# EAGLE design MotorDriver (EAGLE 6.6.0)

## Sheet 1 of 2
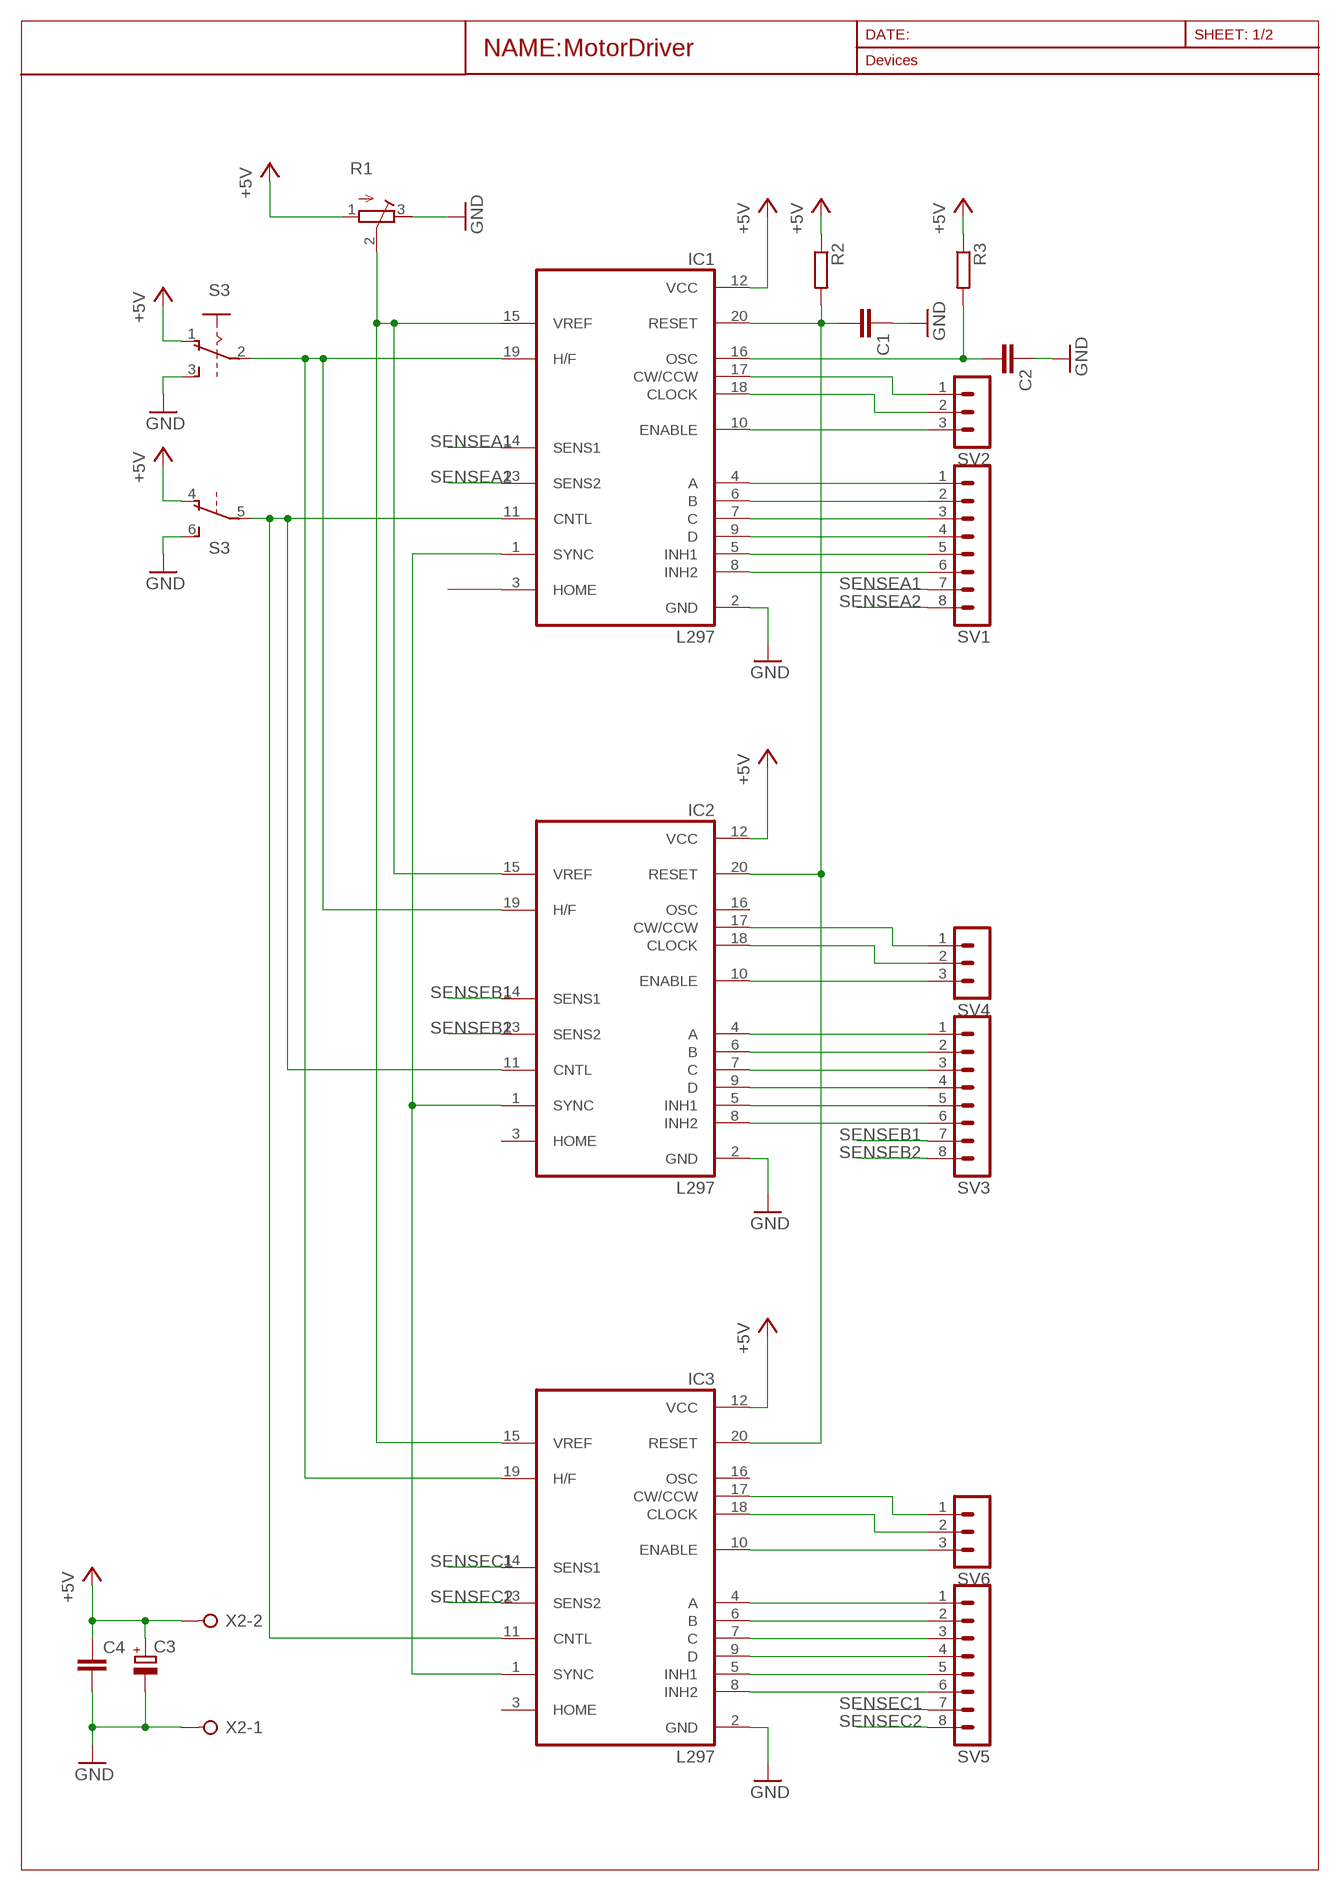
[diagram p0: schematic, sheet 1]

### Parts
C1  C-EU050-024X044  [C050-024X044]
C2  C-EU050-024X044  [C050-024X044]
C3  CPOL-EUE3.5-8  [E3,5-8]
C4  C-EU050-024X044  [C050-024X044]
IC1  L297  [DIL20]
IC2  L297  [DIL20]
IC3  L297  [DIL20]
R1  R-TRIMM64P  [RTRIM64P]
R2  R-EU_0207/10  [0207/10]
R3  R-EU_0207/10  [0207/10]
S3  A68-A31  [A68-A31]
SV1  MA08-1  [MA08-1]
SV2  MA03-1  [MA03-1]
SV3  MA08-1  [MA08-1]
SV4  MA03-1  [MA03-1]
SV5  MA08-1  [MA08-1]
SV6  MA03-1  [MA03-1]
X2  W237-02P  [W237-132]

### Nets
+5V: C3.+ C4.1 IC1.12(VCC) IC2.12(VCC) IC3.12(VCC) R1.1(A) R2.1 R3.1 S3.1(A:O) S3.4(B:O) X2.2
GND: C1.1 C2.1 C3.- C4.2 IC1.2(GND) IC2.2(GND) IC3.2(GND) R1.3(E) S3.3(A:S) S3.6(B:S) X2.1
N$3: C2.2 IC1.16(OSC) R3.2
N$4: IC1.4(A) SV1.1
N$5: IC1.6(B) SV1.2
N$6: IC1.7(C) SV1.3
N$7: IC1.9(D) SV1.4
N$8: IC1.5(INH1) SV1.5
N$9: IC1.8(INH2) SV1.6
N$12: IC1.17(CW/CCW) SV2.1
N$13: IC1.18(CLOCK) SV2.2
N$14: IC1.10(ENABLE) SV2.3
N$17: IC1.19(H/F) IC2.19(H/F) IC3.19(H/F) S3.2(A:P)
N$22: IC1.3(HOME)
N$26: IC1.11(CNTL) IC2.11(CNTL) IC3.11(CNTL) S3.5(B:P)
N$27: IC1.15(VREF) IC2.15(VREF) IC3.15(VREF) R1.2(S)
N$30: IC2.4(A) SV3.1
N$31: IC2.6(B) SV3.2
N$32: IC2.7(C) SV3.3
N$33: IC2.9(D) SV3.4
N$34: IC2.5(INH1) SV3.5
N$35: IC2.8(INH2) SV3.6
N$38: IC2.17(CW/CCW) SV4.1
N$39: IC2.18(CLOCK) SV4.2
N$40: IC2.10(ENABLE) SV4.3
N$45: IC1.1(SYNC) IC2.1(SYNC) IC3.1(SYNC)
N$48: C1.2 IC1.20(RESET) IC2.20(RESET) IC3.20(RESET) R2.2
N$50: IC3.4(A) SV5.1
N$51: IC3.6(B) SV5.2
N$52: IC3.7(C) SV5.3
N$53: IC3.9(D) SV5.4
N$54: IC3.5(INH1) SV5.5
N$55: IC3.8(INH2) SV5.6
N$58: IC3.17(CW/CCW) SV6.1
N$59: IC3.18(CLOCK) SV6.2
N$60: IC3.10(ENABLE) SV6.3
SENSEA1: IC1.14(SENS1) SV1.7
SENSEA2: IC1.13(SENS2) SV1.8
SENSEB1: IC2.14(SENS1) SV3.7
SENSEB2: IC2.13(SENS2) SV3.8
SENSEC1: IC3.14(SENS1) SV5.7
SENSEC2: IC3.13(SENS2) SV5.8
Unconnected: IC2.3(HOME) IC2.16(OSC) IC3.3(HOME) IC3.16(OSC)

## Sheet 2 of 2

## Library data of the parts
C1 C2 C4 = rcl:C-EU: CAPACITOR, European symbol
C3 = rcl:CPOL-EU: POLARIZED CAPACITOR, European symbol
IC1-IC3 = st-microelectronics:L297: STEPPER MOTOR CONTROLLER; MPN: L297/1; OC_FARNELL: 1094209; OC_NEWARK: 56P8258
R1 = rcl:R-TRIMM: Trimm resistor
R2 R3 = rcl:R-EU_: RESISTOR, European symbol
S3 = switch:A68-A31: SLIDING SWITCH Siemens, distributor Buerklin, 11G766
SV1 SV3 SV5 = con-lstb:MA08-1: PIN HEADER; OC_FARNELL: unknown; OC_NEWARK: unknown
SV2 SV4 SV6 = con-lstb:MA03-1: PIN HEADER; OC_FARNELL: unknown; OC_NEWARK: unknown
X2 = con-wago-508:W237-02P: WAGO SREW CLAMP; OC_FARNELL: unknown; OC_NEWARK: unknown

## Board
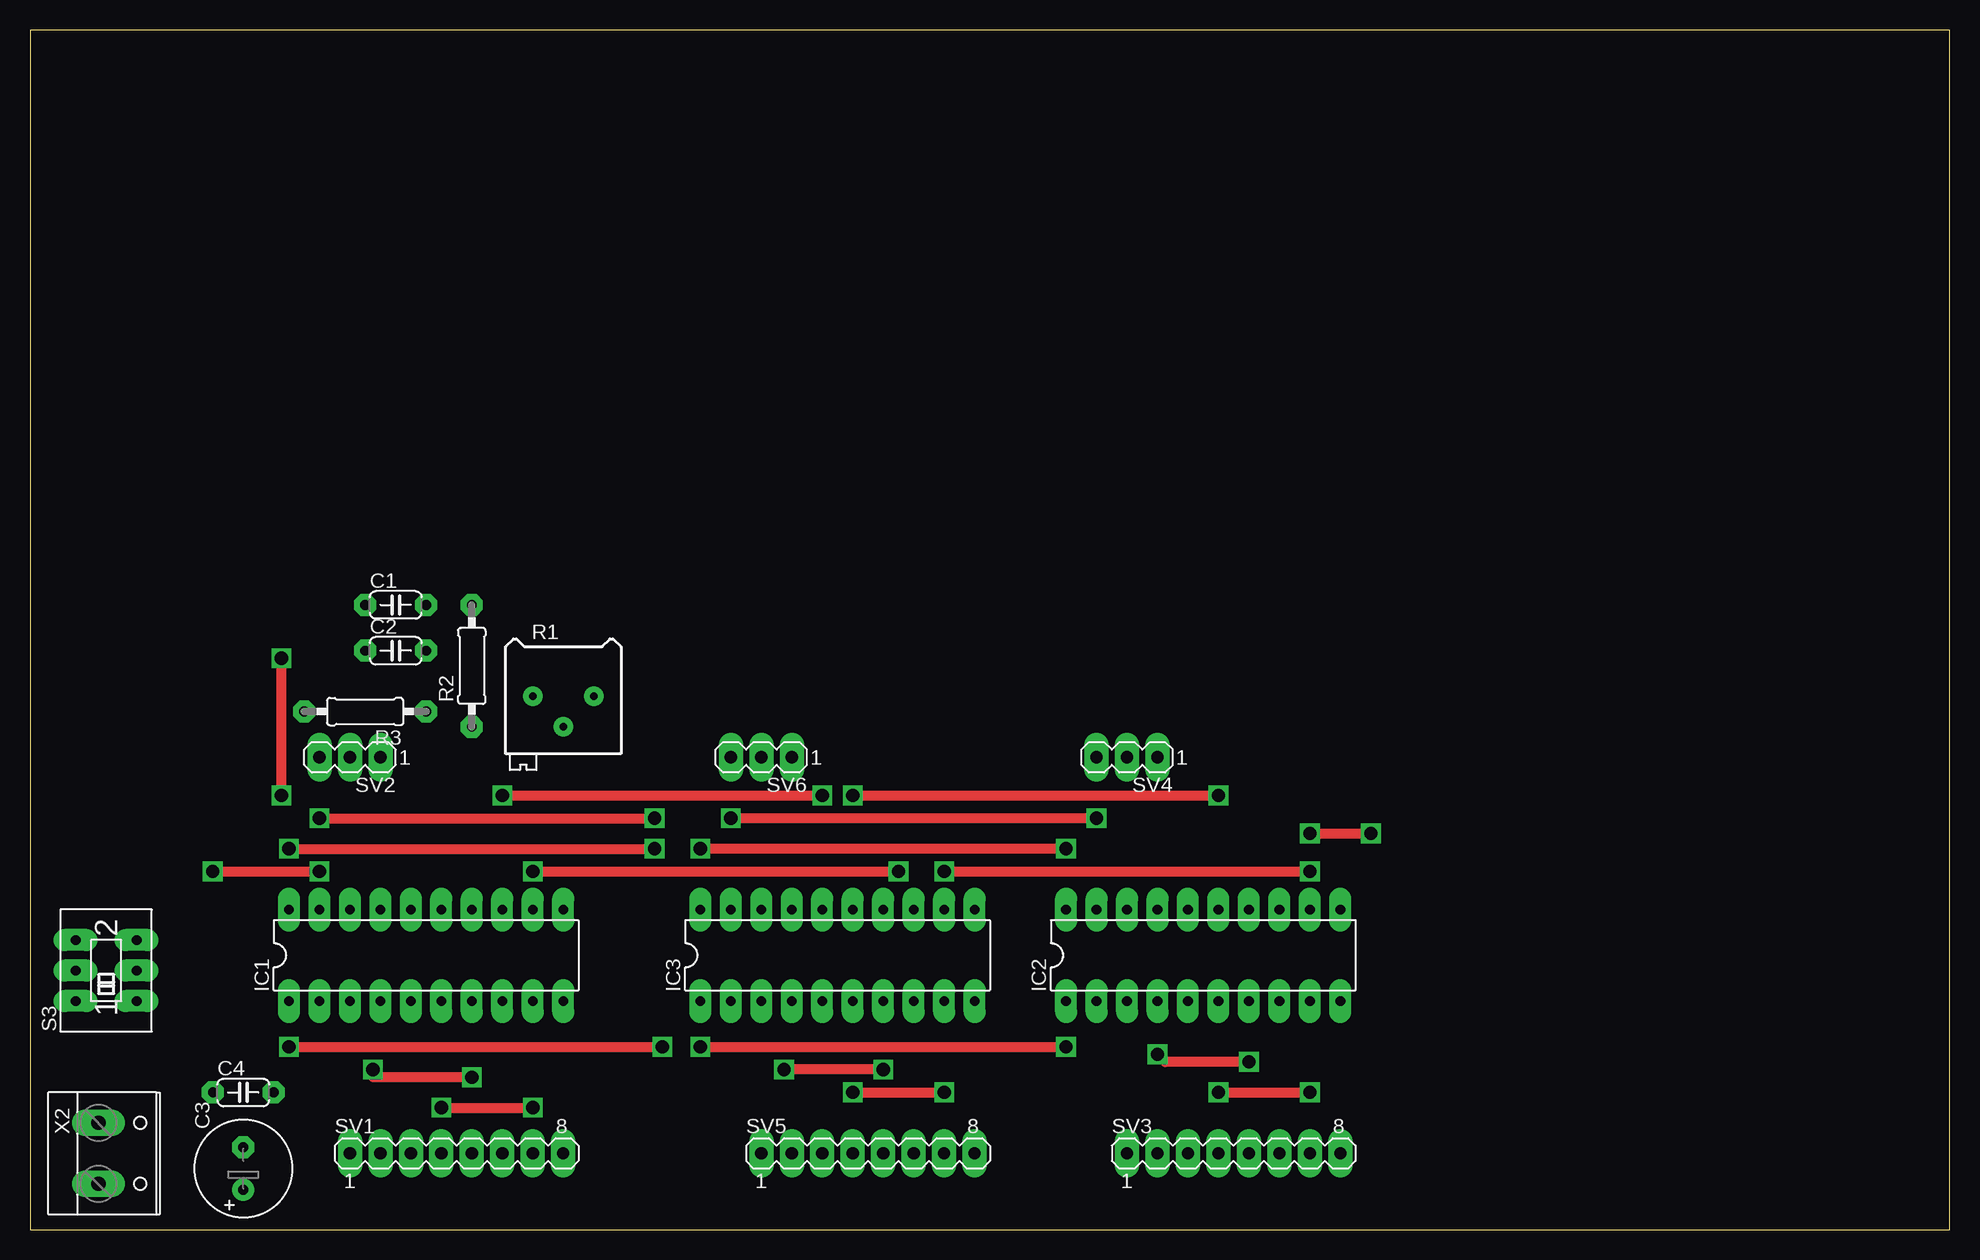
[diagram p1: board, top side]
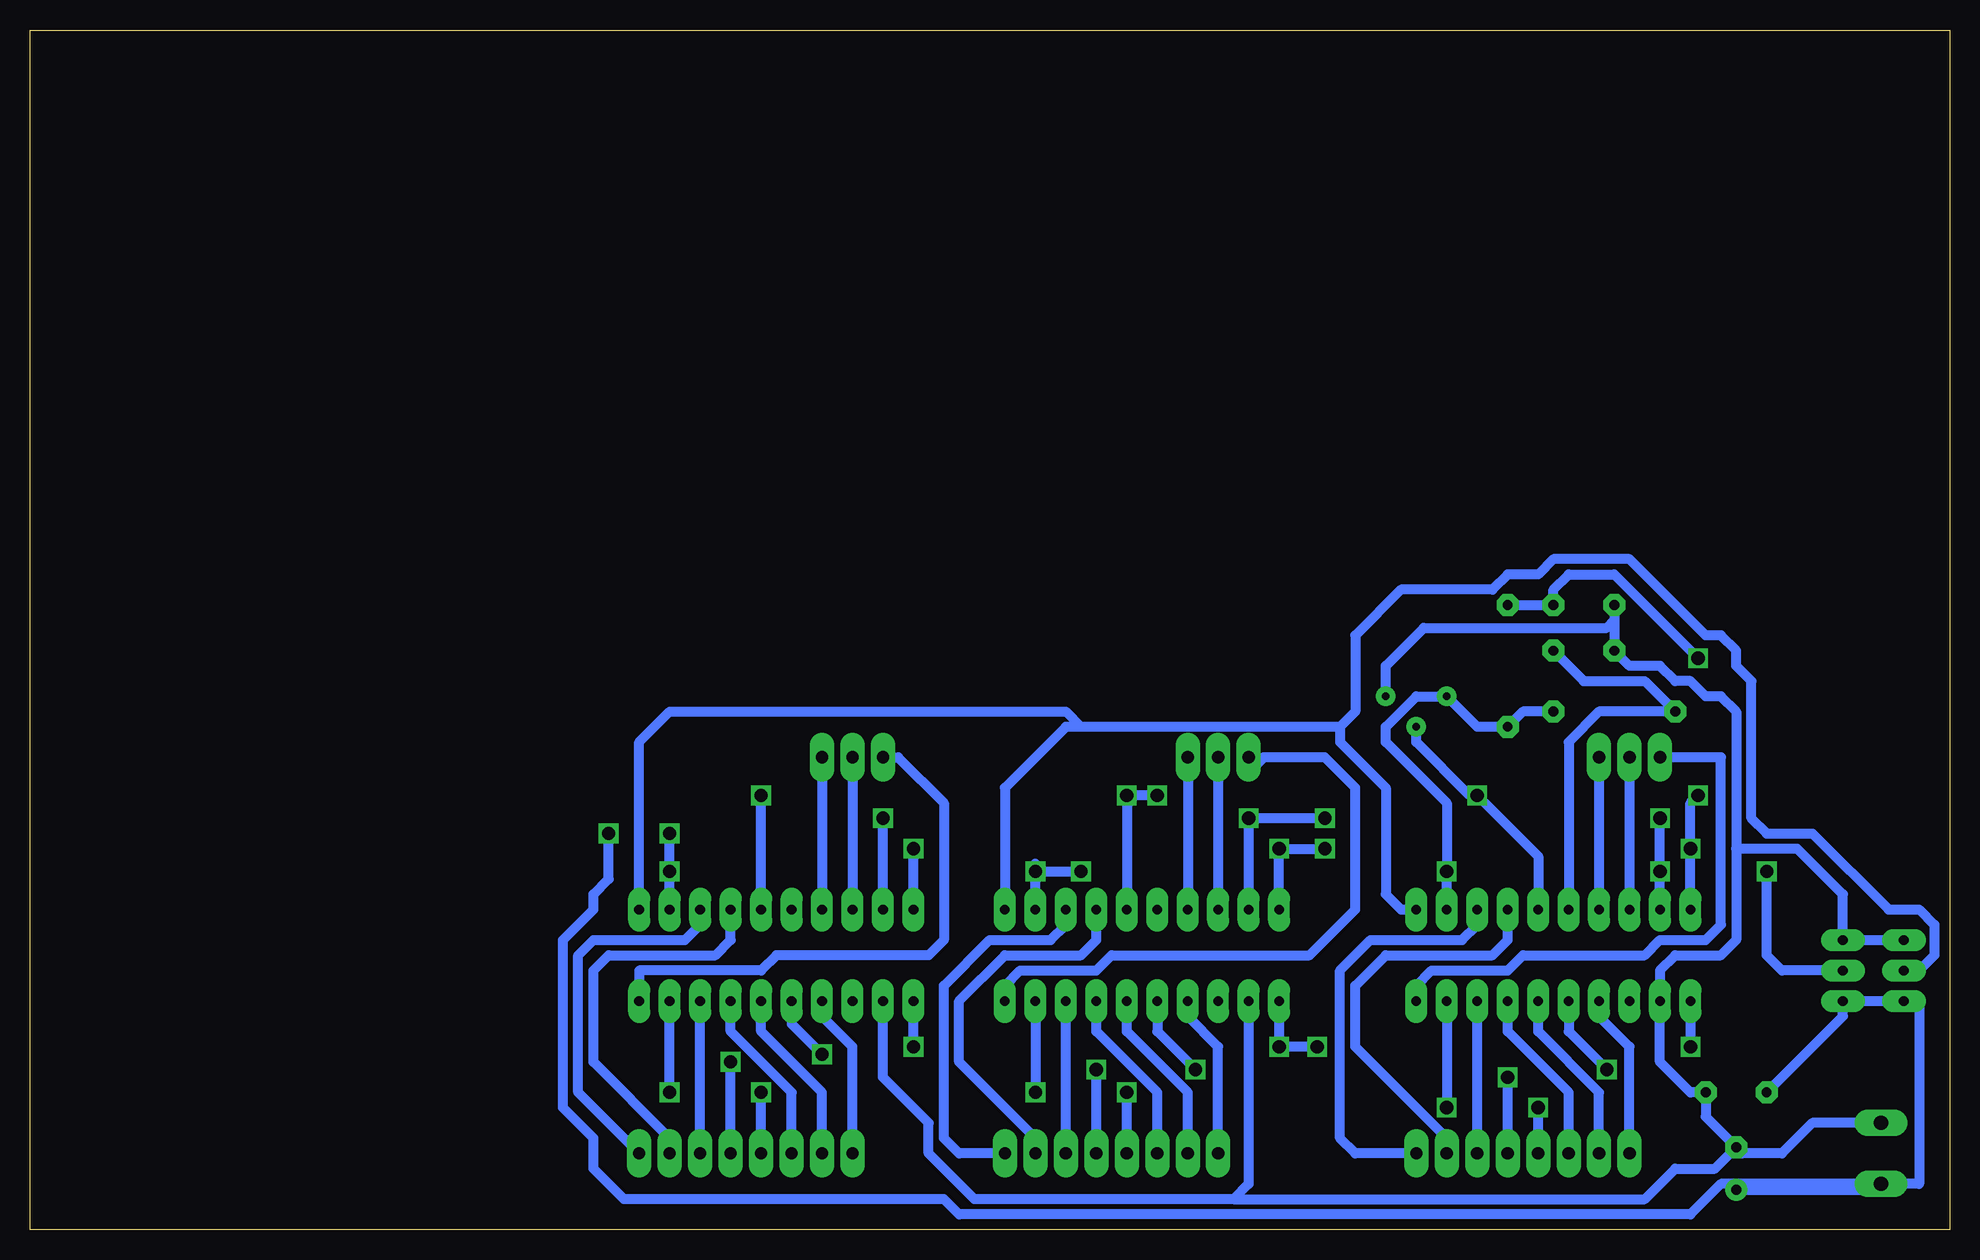
[diagram p2: board, bottom side, seen from below]

Size 160 x 100 mm. Coordinates in mm from the lower left corner, seen from the top.
Outline: 0,0 160,0 160,100 0,100 0,0
Copper layers (1*16): Top 0.035mm / dielectric 1.5mm / Bottom 0.035mm
Design rules "default *": minimum track width 10mil, minimum drill 24mil, track to track 8mil, track to pad 8mil, pad to pad 8mil, via to via 8mil, smd to smd 8mil, copper to edge 40mil, drill to drill 8mil, minimum pad ring 20mil, minimum via ring 8mil, stop-mask expansion 4mil, vias tented up to drill 0mil, thermal gap 10mil

### Footprints (pad centres in the part's own frame; a part is rotated, then mirrored left to right if it is on the bottom)
C050-024X044 = drill 0.813 octagon: 1 -2.54,0; 2 2.54,0
E3,5-8 = drill 0.813 pad 1.6: + -1.778,0 | drill 0.813 pad 1.6 octagon: - 1.778,0
DIL20 = drill 0.813 long: 1 -11.43,-3.81; 2 -8.89,-3.81; 3 -6.35,-3.81; 4 -3.81,-3.81; 5 -1.27,-3.81; 6 1.27,-3.81; 7 3.81,-3.81; 8 6.35,-3.81; 9 8.89,-3.81; 10 11.43,-3.81; 11 11.43,3.81; 12 8.89,3.81; 13 6.35,3.81; 14 3.81,3.81; 15 1.27,3.81; 16 -1.27,3.81; 17 -3.81,3.81; 18 -6.35,3.81; 19 -8.89,3.81; 20 -11.43,3.81
RTRIM64P = drill 0.61: 1 0,-2.54; 2 2.54,0; 3 0,2.54
0207/10 = drill 0.813 octagon: 1 -5.08,0; 2 5.08,0
A68-A31 = drill 0.813 long: 1 -2.54,-2.54; 2 0,-2.54; 3 2.54,-2.54; 4 -2.54,2.54; 5 0,2.54; 6 2.54,2.54
MA08-1 = drill 1.016 long: 1 -8.89,0; 2 -6.35,0; 3 -3.81,0; 4 -1.27,0; 5 1.27,0; 6 3.81,0; 7 6.35,0; 8 8.89,0
MA03-1 = drill 1.016 long: 1 -2.54,0; 2 0,0; 3 2.54,0
W237-132 = drill 1.194 long: 1 -2.54,-0.635; 2 2.54,-0.635

### Placement (x,y rotation side)
C1  30.48,52.07 0 top
C2  30.48,48.26 0 top
C3  17.78,5.08 90 top
C4  17.78,11.43 0 top
IC1  33.02,22.86 0 top
IC2  97.79,22.86 0 top
IC3  67.31,22.86 0 top
R1  44.45,44.45 270 top
R2  36.83,46.99 90 top
R3  27.94,43.18 180 top
S3  6.35,21.59 90 top
SV1  35.56,6.35 0 top
SV2  26.67,39.37 180 top
SV3  100.33,6.35 0 top
SV4  91.44,39.37 180 top
SV5  69.85,6.35 0 top
SV6  60.96,39.37 180 top
X2  6.35,6.35 270 top

### Tracks (layer width: path | path; a pad name or v marks a point on that pad's centre or on a via)
+5V  (via drill 1.1 pad 0.25)
  Top 0.813: v41.91,29.84 v72.39,29.84 | v76.2,29.84 v106.68,29.84 | v106.68,33.02 v111.76,33.02
  Bottom 0.813: S3.1 S3.4 | C3.+ 6.22,3.3 X2.2 | R3.1 35.56,43.18 R2.1 39.37,41.91 R1.1 44.45,44.45 46.99,41.91 46.99,40.64 41.91,35.56 v41.91,29.84 IC1.12 | IC2.12 v106.68,29.84 v106.68,33.02 | v76.2,29.84 v72.39,29.84 | IC3.12 v76.2,29.84 | 76.2,30.48 v76.2,29.84 | X2.2 2.54,3.81 2.54,19.05 S3.1 | C4.1 8.89,17.78 S3.1 | X2.2 19.05,3.81 21.59,1.27 82.55,1.27 83.82,2.54 110.49,2.54 113.03,5.08 113.03,7.62 115.57,10.16 115.57,24.13 113.03,26.67 113.03,27.94 111.76,29.21 v111.76,33.02
GND
  Bottom 0.813: C1.1 27.94,50.8 | 27.94,50.8 C2.1 26.67,46.99 24.13,46.99 22.86,45.72 21.59,45.72 20.32,44.45 19.05,44.45 17.78,43.18 17.78,31.75 | R1.3 46.99,46.99 43.81,50.16 28.57,50.16 27.94,50.8 | S3.6 S3.3 8.89,27.94 12.7,31.75 17.78,31.75 | C3.- 20.32,9.4 C4.2 21.59,11.43 24.13,13.97 IC1.2 24.13,21.59 22.86,22.86 19.05,22.86 17.78,24.13 17.78,31.75 | X2.1 11.43,8.89 13.97,6.35 17.27,6.35 C3.- | 59.69,2.54 81.28,2.54 85.09,6.35 85.09,8.89 88.9,12.7 IC2.2 | IC3.2 58.42,3.81 59.69,2.54 | 59.69,2.54 25.4,2.54 22.86,5.08 19.56,5.08 C3.-
N$3
  Bottom 0.813: C2.2 30.48,45.72 25.4,45.72 R3.2 29.21,43.18 31.75,40.64 IC1.16
N$4
  Bottom 0.813: SV1.1 26.67,15.24 29.21,17.78 IC1.4
N$5
  Bottom 0.813: SV1.2 29.21,11.43 34.29,16.51 IC1.6
N$6
  Bottom 0.813: SV1.3 31.75,11.43 36.83,16.51 IC1.7
N$7  (via drill 1.1 pad 0.25)
  Top 0.813: v34.29,10.16 v41.91,10.16
  Bottom 0.813: SV1.4 v34.29,10.16 | IC1.9 v41.91,10.16
N$8  (via drill 1.1 pad 0.25)
  Top 0.813: v36.83,12.7 28.57,12.7 v28.57,13.34
  Bottom 0.813: IC1.5 31.75,16.51 v28.57,13.34 | SV1.5 v36.83,12.7
N$9
  Bottom 0.813: SV1.6 IC1.8
N$12
  Bottom 0.813: SV2.1 IC1.17
N$13
  Bottom 0.813: SV2.2 IC1.18
N$14
  Bottom 0.813: IC1.10 44.45,20.32 43.18,21.59 36.83,21.59 35.56,22.86 25.4,22.86 24.13,24.13 20.32,24.13 19.05,25.4 19.05,39.37 SV2.3
N$17  (via drill 1.1 pad 0.25)
  Top 0.813: v24.13,34.29 v52.07,34.29 | v88.9,34.29 v58.42,34.29 | v15.24,29.84 v24.13,29.84
  Bottom 0.813: IC1.19 v24.13,29.84 v24.13,34.29 | v52.07,34.29 v58.42,34.29 IC3.19 | IC2.19 v88.9,34.29 | S3.2 13.97,21.59 15.24,22.86 v15.24,29.84
N$26
  Bottom 0.813: 50.8,41.91 49.53,43.18 49.53,49.53 45.72,53.34 38.1,53.34 36.83,54.61 34.29,54.61 33.02,55.88 26.67,55.88 20.32,49.53 19.05,49.53 17.78,48.26 17.78,46.99 16.51,45.72 16.51,34.29 15.24,33.02 11.43,33.02 5.08,26.67 2.54,26.67 1.27,25.4 1.27,22.86 2.54,21.59 S3.5 5.08,21.59 | 50.8,41.91 72.39,41.91 | 72.39,41.91 73.66,41.91 78.74,36.83 IC3.11 | 50.8,41.91 50.8,40.64 46.99,36.83 46.99,27.94 45.72,26.67 IC1.11 | IC2.11 109.22,40.64 106.68,43.18 73.66,43.18 72.39,41.91
N$27  (via drill 1.1 pad 0.25)
  Top 0.813: v39.37,36.2 v66.04,36.2 | v68.58,36.2 v99.06,36.2
  Bottom 0.813: IC1.15 34.29,31.11 v39.37,36.2 40.01,36.2 44.45,40.64 R1.2 | v66.04,36.2 v68.58,36.2 IC3.15 | IC2.15 v99.06,36.2
N$30
  Bottom 0.813: SV3.1 91.44,15.24 93.98,17.78 IC2.4
N$31
  Bottom 0.813: SV3.2 93.98,11.43 99.06,16.51 IC2.6
N$32
  Bottom 0.813: SV3.3 96.52,11.43 101.6,16.51 IC2.7
N$33  (via drill 1.1 pad 0.25)
  Top 0.813: v99.06,11.43 v106.68,11.43
  Bottom 0.813: SV3.4 v99.06,11.43 | v106.68,11.43 IC2.9
N$34  (via drill 1.1 pad 0.25)
  Top 0.813: v101.6,13.97 94.61,13.97 v93.98,14.61
  Bottom 0.813: IC2.5 96.52,17.14 v93.98,14.61 | SV3.5 v101.6,13.97
N$35
  Bottom 0.813: SV3.6 IC2.8
N$38
  Bottom 0.813: SV4.1 IC2.17
N$39
  Bottom 0.813: SV4.2 IC2.18
N$40
  Bottom 0.813: SV4.3 87.63,39.37 83.82,35.56 83.82,24.13 85.09,22.86 97.79,22.86 99.06,21.59 109.22,21.59 IC2.10
N$45  (via drill 1.1 pad 0.25)
  Top 0.813: v21.59,15.24 v52.7,15.24 | v55.88,15.24 v86.36,15.24
  Bottom 0.813: IC1.1 v21.59,15.24 | v52.7,15.24 v55.88,15.24 IC3.1 | v86.36,15.24 IC2.1
N$48  (via drill 1.1 pad 0.25)
  Top 0.813: v21.59,31.75 v52.07,31.75 | v86.36,31.75 v55.88,31.75 | v20.95,47.62 v20.95,36.2
  Bottom 0.813: R2.2 C1.2 33.02,53.34 31.75,54.61 27.94,54.61 v20.95,47.62 | IC1.20 v21.59,31.75 21.59,35.56 v20.95,36.2 | IC3.20 v55.88,31.75 v52.07,31.75 | IC2.20 v86.36,31.75
N$50
  Bottom 0.813: SV5.1 60.96,15.24 63.5,17.78 IC3.4
N$51
  Bottom 0.813: SV5.2 63.5,11.43 68.58,16.51 IC3.6
N$52
  Bottom 0.813: SV5.3 66.04,11.43 71.12,16.51 IC3.7
N$53  (via drill 1.1 pad 0.25)
  Top 0.813: v68.58,11.43 v76.2,11.43
  Bottom 0.813: SV5.4 v68.58,11.43 | IC3.9 v76.2,11.43
N$54  (via drill 1.1 pad 0.25)
  Top 0.813: v71.12,13.34 v62.87,13.34
  Bottom 0.813: IC3.5 66.04,16.51 v62.87,13.34 | SV5.5 v71.12,13.34
N$55
  Bottom 0.813: SV5.6 IC3.8
N$58
  Bottom 0.813: SV6.1 IC3.17
N$59
  Bottom 0.813: SV6.2 IC3.18
N$60
  Bottom 0.813: IC3.10 78.74,20.32 77.47,21.59 71.12,21.59 69.85,22.86 53.34,22.86 49.53,26.67 49.53,36.83 52.07,39.37 57.15,39.37 58.42,38.1 SV6.3
SENSEA1
  Bottom 0.813: SV1.7 41.91,7.62 49.53,15.24 49.53,20.32 46.99,22.86 38.1,22.86 36.83,24.13 IC1.14
SENSEA2
  Bottom 0.813: SV1.8 49.53,6.35 50.8,7.62 50.8,21.59 48.26,24.13 40.64,24.13 39.37,25.4 IC1.13
SENSEB1
  Bottom 0.813: SV3.7 106.68,7.62 113.03,13.97 113.03,21.59 111.76,22.86 102.87,22.86 101.6,24.13 IC2.14
SENSEB2
  Bottom 0.813: SV3.8 114.3,11.43 114.3,22.86 113.03,24.13 105.41,24.13 104.14,25.4 IC2.13
SENSEC1
  Bottom 0.813: SV5.7 76.2,7.62 82.55,13.97 82.55,19.05 78.74,22.86 72.39,22.86 71.12,24.13 IC3.14
SENSEC2
  Bottom 0.813: SV5.8 82.55,6.35 83.82,7.62 83.82,20.32 80.01,24.13 74.93,24.13 73.66,25.4 IC3.13